# EAGLE schematic directly_driven_md (EAGLE 9.6.2)

## Sheet 1 of 2
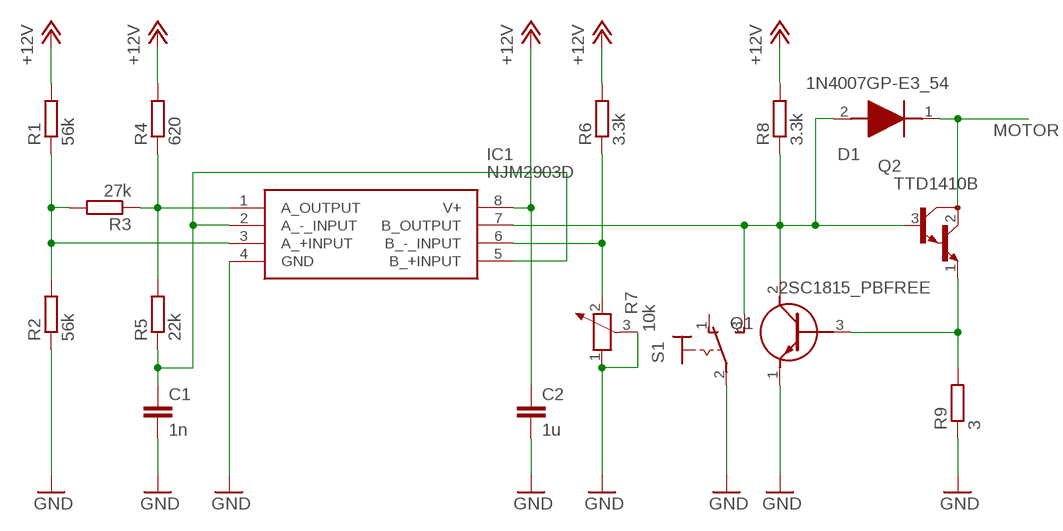
[diagram p0: schematic, sheet 1]

### Parts
C1  1n  C-EU025-025X050  [C025-025X050]
C2  1u  C-EU025-025X050  [C025-025X050]
D1  1N4007GP-E3_54  [DIOAD1405W86L465D235]
IC1  NJM2903D  [DIP762W56P254L880H425Q8N]
Q1  2SC1815_PBFREE  [2SC1815PBFREE]
Q2  TTD1410B  [TO220AV]
R1  56k  R-EU_0207/10  [0207/10]
R2  56k  R-EU_0207/10  [0207/10]
R3  27k  R-EU_0207/10  [0207/10]
R4  620  R-EU_0207/10  [0207/10]
R5  22k  R-EU_0207/10  [0207/10]
R6  3.3k  R-EU_0207/10  [0207/10]
R7  10k  POTENTIOMETER_PT-10  [PT-10]
R8  3.3k  R-EU_0204/7  [0204/7]
R9  3  R-EU_0204/7  [0204/7]
S1  320-916  [320-916]

### Nets
+12V: C2.1 IC1.8(V+) R1.2 R4.2 R6.2 R8.2 ; also sheet 2
GND: C1.2 C2.2 IC1.4(GND) Q1.1(E) R2.1 R7.1 R7.3 R9.1 S1.2(P) ; also sheet 2
MOTOR: D1.1(K) Q2.2(C) ; also sheet 2
N$10: IC1.1(A_OUTPUT) R3.1 R4.1 R5.2
N$15: C1.1 IC1.2(A_-_INPUT) IC1.5(B_+INPUT) R5.1
N$16: IC1.3(A_+INPUT) R1.1 R2.2 R3.2
N$23: D1.2(A) IC1.7(B_OUTPUT) Q1.2(C) Q2.3(B) R8.1 S1.3(S)
N$29: Q1.3(B) Q2.1(E) R9.2
N$34: IC1.6(B_-_INPUT) R6.1 R7.2
Unconnected: S1.1(O)

## Sheet 2 of 2
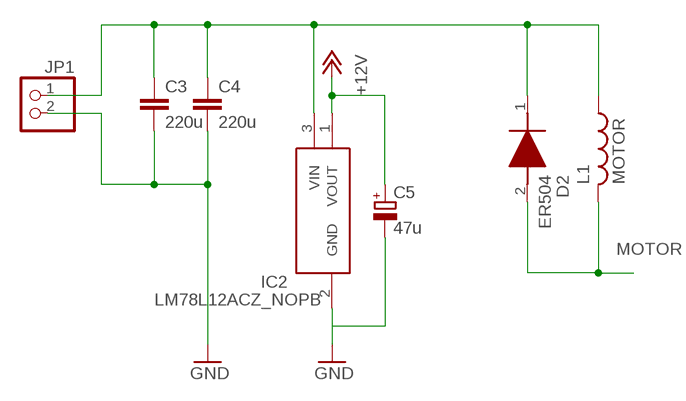
[diagram p1: schematic, sheet 2]

### Parts
C3  220u  C-EU025-025X050  [C025-025X050]
C4  220u  C-EU025-025X050  [C025-025X050]
C5  47u  CPOL-EUE2,5-6E  [E2,5-6E]
D2  ER504  [DIOAD2855W130L835D505]
IC2  LM78L12ACZ_NOPB  [LP0003A]
JP1  PINHD-1X2  [1X02]
L1  MOTOR  L-US0207/15  [0207/15]

### Nets
+12V: C5.+ IC2.1(VOUT) ; also sheet 1
GND: C3.2 C4.2 IC2.2(GND) JP1.2 ; also sheet 1
MOTOR: D2.2(A) L1.2 ; also sheet 1
N$2: C5.-
N$17: C3.1 C4.1 D2.1(K) IC2.3(VIN) JP1.1 L1.1

## Library data of the parts
C1-C4 = rcl:C-EU: CAPACITOR, European symbol; SPICEPREFIX: C
C5 = rcl:CPOL-EU: POLARIZED CAPACITOR, European symbol; SPICEPREFIX: C
D1 = SamacSys_Parts:1N4007GP-E3_54: Vishay 1N4007GP-E3/54, Switching Diode, 1000V 1A, 2000ns, 2-Pin DO-204AL Source: Datasheet <https://componentsearchengine.com/Datasheets/2/1N4007GP-E3_54.pdf>; ARROW_PART_NUMBER: 1N4007GP-E3/54; ARROW_PRICE-STOCK: https://www.arrow.com/en/products/1n4007gp-e354/vishay?region=europe; DESCRIPTION: Vishay 1N4007GP-E3/54, Switching Diode, 1000V 1A, 2000ns, 2-Pin DO-204AL; HEIGHT: mm; MANUFACTURER_NAME: Vishay; MANUFACTURER_PART_NUMBER: 1N4007GP-E3/54; MOUSER_PART_NUMBER: 625-1N4007GP-E3/54; MOUSER_PRICE-STOCK: https://www.mouser.co.uk/ProductDetail/Vishay-General-Semiconductor/1N4007GP-E3-54?qs=N4vtoAxH%2FSroP3EzTqv8Nw%3D%3D
D2 = SamacSys_Parts:ER504: Precision Thick Film Chip Resistor Source: Datasheet <https://www.panjit.com.tw/upload/datasheet/ER500_SERIES.pdf>; DESCRIPTION: Precision Thick Film Chip Resistor; HEIGHT: mm; MANUFACTURER_NAME: PANJIT International; MANUFACTURER_PART_NUMBER: ER504
IC1 = SamacSys_Parts:NJM2903D: Comparator,2ch,General,DIP8 Source: Datasheet <https://datasheet.datasheetarchive.com/originals/distributors/Datasheets-22/DSA-438387.pdf>; DESCRIPTION: Comparator,2ch,General,DIP8; HEIGHT: 4.25mm; MANUFACTURER_NAME: New Japan Radio; MANUFACTURER_PART_NUMBER: NJM2903D; MOUSER_PART_NUMBER: 513-NJM2903D; MOUSER_PRICE-STOCK: https://www.mouser.co.uk/ProductDetail/NJR/NJM2903D?qs=3YhdU5s%252B0lZSUsNyNge3WQ%3D%3D
IC2 = SamacSys_Parts:LM78L12ACZ_NOPB: Texas Instruments LM78L12ACZ/NOPB Linear Voltage Regulator, 100mA, 12 V, +/-5% 3-Pin, TO-92 Source: Datasheet <http://www.ti.com.cn/cn/lit/ds/symlink/lm78l.pdf>; ARROW_PART_NUMBER: LM78L12ACZ/NOPB; ARROW_PRICE-STOCK: https://www.arrow.com/en/products/lm78l12acznopb/texas-instruments?region=nac; DESCRIPTION: Texas Instruments LM78L12ACZ/NOPB Linear Voltage Regulator, 100mA, 12 V, +/-5% 3-Pin, TO-92; HEIGHT: mm; MANUFACTURER_NAME: Texas Instruments; MANUFACTURER_PART_NUMBER: LM78L12ACZ/NOPB; MOUSER_PART_NUMBER: 926-LM78L12ACZ/NOPB; MOUSER_PRICE-STOCK: https://www.mouser.co.uk/ProductDetail/Texas-Instruments/LM78L12ACZ-NOPB?qs=QbsRYf82W3GCBYUn4JFrcg%3D%3D
JP1 = pinhead:PINHD-1X2: PIN HEADER
L1 = rcl:L-US: INDUCTOR, American symbol; SPICEPREFIX: L
Q1 = SamacSys_Parts:2SC1815_PBFREE: Bipolar Transistors - BJT 60Vcbo 50Vceo 5.0V 150mA 400mA 400mW Source: Datasheet <https://my.centralsemi.com/get_document.php?cmp=1&mergetype=pd&mergepath=pd&pdf_id=2SC1815.PDF>; ARROW_PART_NUMBER: 2SC1815 PBFREE; ARROW_PRICE-STOCK: https://www.arrow.com/en/products/2sc1815-pbfree/central-semiconductor?region=nac; DESCRIPTION: Bipolar Transistors - BJT 60Vcbo 50Vceo 5.0V 150mA 400mA 400mW; HEIGHT: 5.33mm; MANUFACTURER_NAME: Central Semiconductor; MANUFACTURER_PART_NUMBER: 2SC1815 PBFREE; MOUSER_PART_NUMBER: 610-2SC1815; MOUSER_PRICE-STOCK: https://www.mouser.co.uk/ProductDetail/Central-Semiconductor/2SC1815-PBFREE?qs=u16ybLDytRZLUNBf8BQ9Lw%3D%3D
Q2 = original:TTD1410B
R1-R6 R8 R9 = rcl:R-EU_: RESISTOR, European symbol; SPICEPREFIX: R
R7 = rcl:POTENTIOMETER_: Potentiometer; SPICEMODEL: POT; SPICEPREFIX: X
S1 = switch:320-916: TOGGLE SWITCH distributor RS Components